# EAGLE schematic schematic (EAGLE 8.6.0)
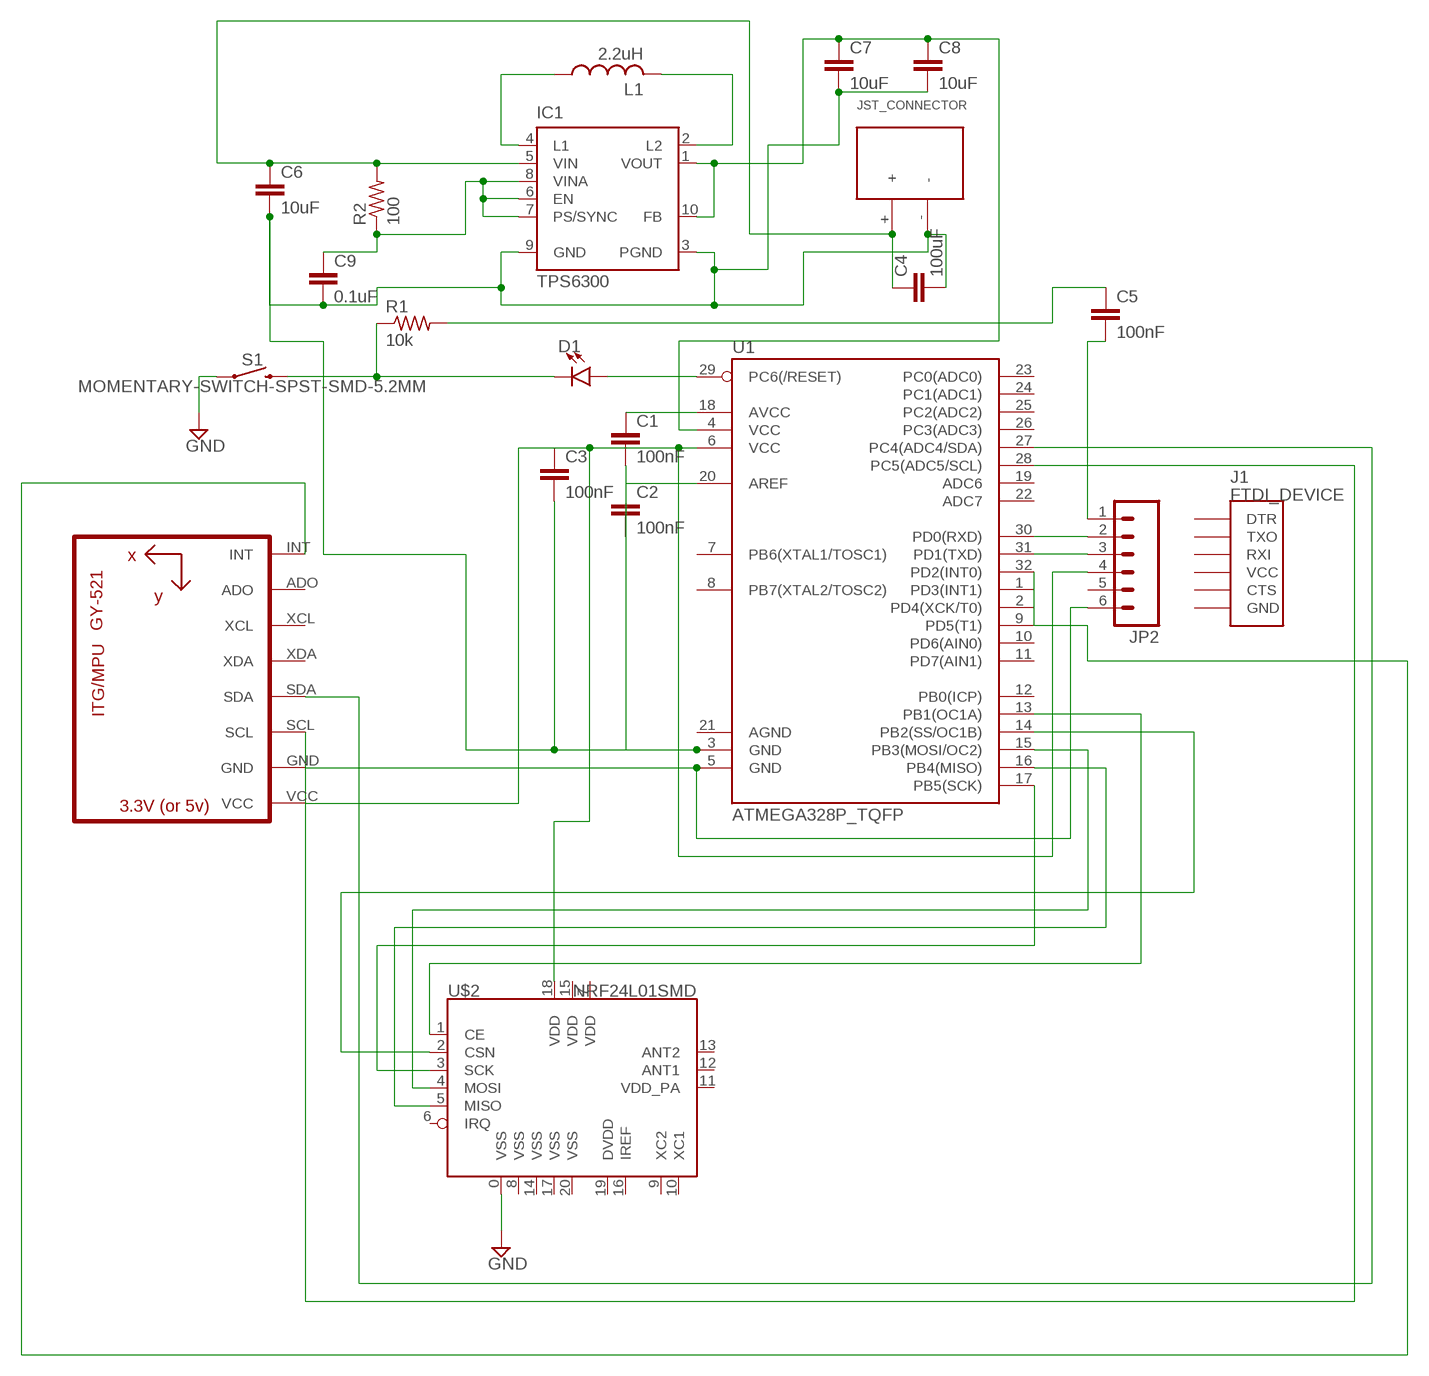
[diagram p0: schematic, sheet 1]

## Parts
C1  100nF  C-EUC0603  [C0603]
C2  100nF  C-EUC0603  [C0603]
C3  100nF  C-EUC0603  [C0603]
C4  100uF  C-EUC2220K  [C2220K]
C5  100nF  C-EUC0603  [C0603]
C6  10uF  C-EUC0603  [C0603]
C7  10uF  C-EUC0603  [C0603]
C8  10uF  C-EUC0603  [C0603]
C9  0.1uF  C-EUC0603  [C0603]
D1  LED0603  [LED-0603]
IC1  TPS6300  [DRC-S-PVSON-N10]
J1  FTDI_DEVICE  [FTDI_DEVICE_SIDE]
JP2  M06SMD-FEMALE-V2  [1X06-SMD-FEMALE-V2]
L1  2.2uH  L-US0204/5  [0204/5]
R1  10k  R-US_R0603  [R0603]
R2  100  R-US_R0603  [R0603]
S1  MOMENTARY-SWITCH-SPST-SMD-5.2MM  [TACTILE_SWITCH_SMD_5.2MM]
U1  ATMEGA328P_TQFP  [TQFP32-08]
U2  GY-521MPU6050  [GY-521]
U$1  JST_CONNECTOR_FEMALE  [JST_CONNECTOR_FEMALE]
U$2  NRF24L01SMD  [QFN20-4X4MM]

## Nets
GND: S1.1 U$2.0(VSS)
N$1: C1.1 U1.18(AVCC)
N$2: C2.1 U1.20(AREF)
N$3: JP2.2 U1.30(PD0(RXD))
N$4: JP2.3 U1.31(PD1(TXD))
N$6: C4.1 C6.1 IC1.5(VIN) R2.2 U$1.+
N$7: C1.2 C2.2 C3.2 C4.2 C6.2 C7.2 C8.2 C9.2 IC1.3(PGND) IC1.9(GND) U1.3(GND) U$1.-
N$9: JP2.6 U1.5(GND) U2.GND
N$10: C5.2 JP2.1
N$11: C5.1 R1.2
N$12: D1.A U1.29(PC6(/RESET))
N$13: D1.C R1.1 S1.3
N$14: U1.15(PB3(MOSI/OC2)) U$2.4(MOSI)
N$15: U1.16(PB4(MISO)) U$2.5(MISO)
N$16: C3.1 JP2.4 U1.6(VCC) U2.VCC U$2.18(VDD)
N$17: U1.28(PC5(ADC5/SCL)) U2.SCL
N$18: U1.27(PC4(ADC4/SDA)) U2.SDA
N$19: U1.32(PD2(INT0)) U2.INT
N$20: U1.17(PB5(SCK)) U$2.3(SCK)
N$21: U1.13(PB1(OC1A)) U$2.1(CE)
N$22: U1.14(PB2(SS/OC1B)) U$2.2(CSN)
N$23: IC1.4(L1) L1.1
N$24: IC1.2(L2) L1.2
N$25: C7.1 C8.1 IC1.1(VOUT) IC1.10(FB) U1.4(VCC)
N$28: C9.1 IC1.6(EN) IC1.7(PS/SYNC) IC1.8(VINA) R2.1
Unconnected: IC1.TH J1.P$1(DTR) J1.P$2(TXO) J1.P$3(RXI) J1.P$4(VCC) J1.P$5(CTS) J1.P$6(GND) JP2.5 U1.1(PD3(INT1)) U1.2(PD4(XCK/T0)) U1.7(PB6(XTAL1/TOSC1)) U1.8(PB7(XTAL2/TOSC2)) U1.9(PD5(T1)) U1.10(PD6(AIN0)) U1.11(PD7(AIN1)) U1.12(PB0(ICP)) U1.19(ADC6) U1.21(AGND) U1.22(ADC7) U1.23(PC0(ADC0)) U1.24(PC1(ADC1)) U1.25(PC2(ADC2)) U1.26(PC3(ADC3)) U2.ADO U2.XCL U2.XDA U$2.6(IRQ) U$2.9(XC2) U$2.10(XC1) U$2.12(ANT1) U$2.13(ANT2) U$2.16(IREF)

## Power pins joined to a net without a drawn wire
DVDD: U$2.19(DVDD)
VDD: U$2.7(VDD) U$2.15(VDD)
VDD_PA: U$2.11(VDD_PA)
VSS: U$2.8(VSS) U$2.14(VSS) U$2.17(VSS) U$2.20(VSS)

## Library data of the parts
C1-C9 = rcl:C-EU: CAPACITOR, European symbol; SPICEPREFIX: C
D1 = SparkFun-LED:LED: LED (Generic) Standard schematic elements and footprints for 5mm, 3mm, 1206, and 0603 sized LEDs. Generic LEDs with no color specified.
IC1 = texas:TPS6300*: HIGH EFFICIENT SINGLE INDUCTOR BUCK-BOOST CONVERTER WITH 1.8-A SWITCHES Source: http://focus.ti.com/lit/ds/symlink/tps63001.pdf; MPN: TPS63000DRCTG4; OC_FARNELL: 1511852; OC_NEWARK: 59M7217
J1 = quad:FTDI_DEVICE: Connector which mates to FTDI basic or FTDI cable.
JP2 = SparkFun:M06: Header 6 Standard 6-pin 0.1" header. Use with straight break away headers (SKU : PRT-00116), right angle break away headers (PRT-00553), swiss pins (PRT-00743), machine pins (PRT-00117), and female headers (PRT-00115). Molex polarized connector foot print use with SKU : PRT-08094 with associated crimp pins and housings. NOTES ON THE VARIANTS LOCK and LOCK_LONGPADS... This footprint was designed to help hold the alignment of a through-hole component (i.e. 6-pin header) while soldering it into place. You may notice that each hole has been shifted either up or down by 0.005 of an inch from it's more standard position (which is a perfectly straight line). This slight alteration caused the pins (the squares in the middle) to touch the edges of the holes. Because they are alternating, it causes a "brace" to hold the component in place. 0.005 has proven to be the perfect amount of "off-center" position when using our standard breakaway headers. Although looks a little odd when you look at the bare footprint, once you have a header in there, the alteration is very hard to notice. Also, if you push a header all the way into place, it is covered up entirely on the bottom side. This idea of altering the position of holes to aid alignment will be further integrated into the Sparkfun Library for other footprints. It can help hold any component with 3 or more connection pins.
L1 = rcl:L-US: INDUCTOR, American symbol; SPICEPREFIX: L
R1 = resistor:R-US_: RESISTOR, American symbol
R2 = rcl:R-US_: RESISTOR, American symbol; SPICEPREFIX: R
S1 = SparkFun-Switches:MOMENTARY-SWITCH-SPST: Momentary Switch (Pushbutton) - SPST Normally-open (NO) SPST momentary switches (buttons, pushbuttons). Variants PTH-12MM - 12mm square, through-hole Momentary Pushbutton Switch - 12mm Square <https://www.sparkfun.com/products/9190> (COM-09190) PTH-6.0MM, PTH-6.0MM-KIT - 6.0mm square, through-hole Mini Pushbutton Switch <https://www.sparkfun.com/products/97> (COM-00097) KIT package intended for soldering kit's - only one side of pads' copper is exposed. PTH-RIGHT-ANGLE-KIT - Right-angle, through-hole Right Angle Tactile Button <https://www.sparkfun.com/products/10791> - Used on SparkFun BigTime Watch Kit <https://www.sparkfun.com/products/11734> SMD-12MM - 12mm square, surface-mount Tactile Button - SMD (12mm) <https://www.sparkfun.com/products/12993> (COM-12993) Used on SparkFun PicoBoard <https://www.sparkfun.com/products/11888> SMD-4.5MM - 4.5mm Square Trackball Switch Used on SparkFun Blackberry Trackballer Breakout <https://www.sparkfun.com/products/13169> SMD-4.6MMX2.8MM - 4.60mm x 2.80mm, surface mount Used on SparkFun SAMD21 Mini Breakout <https://www.sparkfun.com/products/13664> SMD-5.2MM, SMD-5.2-REDUNDANT - 5.2mm square, surface-mount Mini Pushbutton Switch - SMD <https://www.sparkfun.com/products/8720> (COM-08720) Used on Arduino Pro Mini <https://www.sparkfun.com/products/11114> REDUNDANT package connects both switch circuits together SMD-6.0X3.5MM - 6.0 x 3.5mm, surface mount Momentary Reset Switch SMD <https://www.sparkfun.com/products/8229> (COM-08229) SMD-6.2MM-TALL - 6.2mm square, surface mount Tactile Button - SMD (6mm) <https://www.sparkfun.com/products/12992> Used on SparkFun Digital Sandbox <https://www.sparkfun.com/products/12651> SMD-RIGHT-ANGLE - Right-angle, surface mount Used on SparkFun Block for Intel® Edison - Arduino <https://www.sparkfun.com/products/13036>; PROD_ID: SWCH-08247; SF_SKU: COM-08720
U1 = quad:ATMEGA328P_TQFP; PROD_ID: IC-09069
U2 = quad:GY-521
U$1 = quad:JST_CONNECTOR_FEMALE
U$2 = SparkFun-RF:NRF24L01: Nordic nrf24L01 2.4GHz Low-power Transceiver This is the very popular, low cost, very low power RF transceiver from Nordic Semiconductor. Simple SPI interface. SparkFun Products 2.4GHz Transceiver IC - nRF24L01+ <https://www.sparkfun.com/products/690> (COM-00690) SparkFun Transceiver Breakout - nRF24L01+ (RP-SMA) <https://www.sparkfun.com/products/705> (WRL-00705) SparkFun Transceiver Breakout - nRF24L01+ <https://www.sparkfun.com/products/691> (COM-00691); PROD_ID: IC-08950; SF_ID: COM-00690